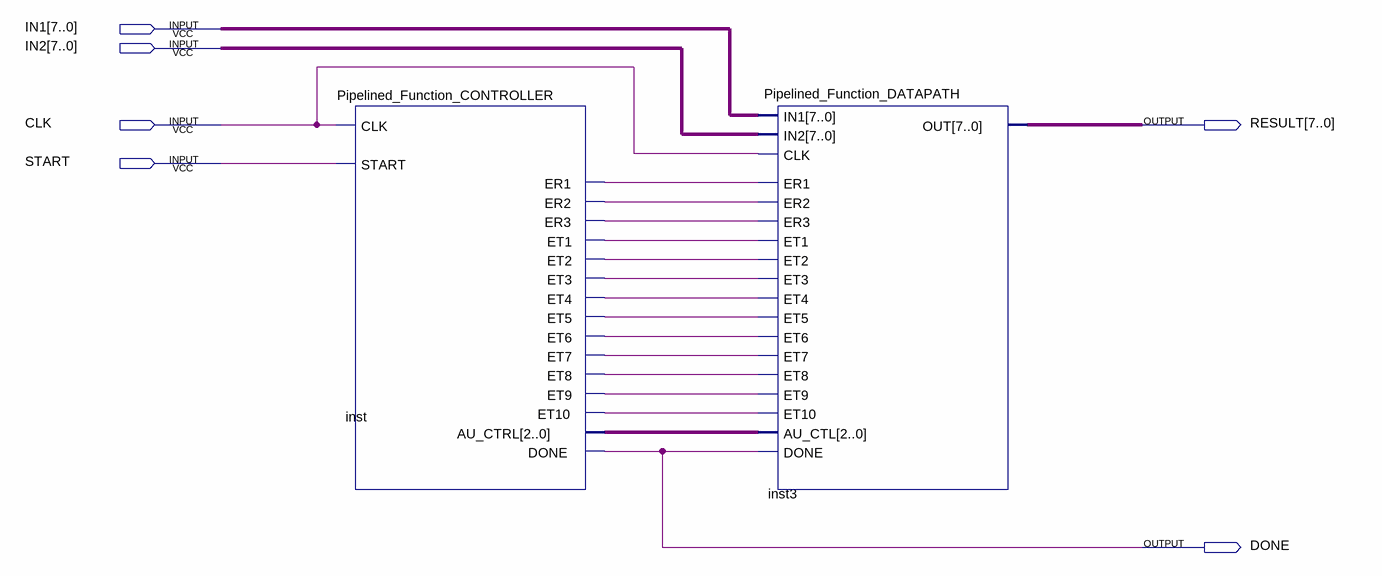
[diagram p0: schematic sheet]
// Quartus schematic Pipelined_Function.bdf as structural Verilog: 2 symbols, 6 pins
module Pipelined_Function (
  input  [7:0] IN1,
  input  [7:0] IN2,
  input  CLK,
  input  START,
  output [7:0] RESULT,
  output DONE
);

  wire inst_er1, inst_er2, inst_er3, inst_et1, inst_et2, inst_et3, inst_et4, inst_et5, inst_et6, inst_et7,
       inst_et8, inst_et9, inst_et10;
  wire [2:0] inst_au_ctrl;

  Pipelined_Function_CONTROLLER inst (
    .CLK(CLK), .START(START), .ER1(inst_er1), .ER2(inst_er2), .ER3(inst_er3), .ET1(inst_et1), .ET2(inst_et2),
    .ET3(inst_et3), .ET4(inst_et4), .ET5(inst_et5), .ET6(inst_et6), .ET7(inst_et7), .ET8(inst_et8),
    .ET9(inst_et9), .ET10(inst_et10), .AU_CTRL(inst_au_ctrl), .DONE(DONE));
  Pipelined_Function_DATAPATH inst3 (
    .CLK(CLK), .IN1(IN1), .IN2(IN2), .ER1(inst_er1), .ER2(inst_er2), .ER3(inst_er3), .ET1(inst_et1),
    .ET2(inst_et2), .ET3(inst_et3), .ET4(inst_et4), .ET5(inst_et5), .ET6(inst_et6), .ET7(inst_et7),
    .ET8(inst_et8), .ET9(inst_et9), .ET10(inst_et10), .AU_CTL(inst_au_ctrl), .DONE(DONE), .OUT(RESULT));
endmodule
